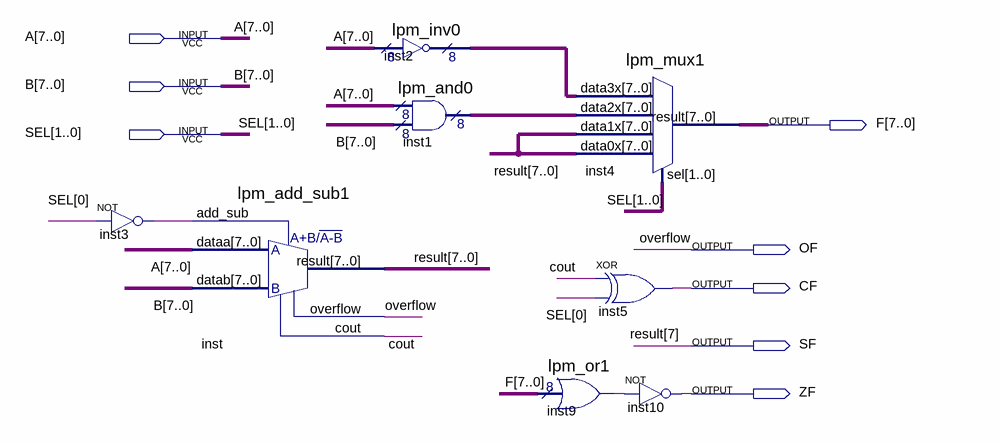
[diagram p0: schematic sheet]
// Quartus schematic ALU.bdf as structural Verilog: 8 symbols, 8 pins
module ALU (
  input  [7:0] A,
  input  [7:0] B,
  input  [1:0] SEL,
  output [7:0] F,
  output OF,
  output CF,
  output SF,
  output ZF
);

  wire cout, inst3_out, inst9_result;
  wire [6:0] result;
  wire [7:0] inst1_result, inst2_result;

  not inst3 (inst3_out, SEL[0]);
  lpm_add_sub1 inst (.dataa(A), .datab(B), .add_sub(inst3_out), .result({SF, result}), .overflow(OF), .cout(cout));
  lpm_inv0 inst2 (.data(A), .result(inst2_result));
  lpm_and0 inst1 (.data0x(A), .data1x(B), .result(inst1_result));
  lpm_or1 inst9 (.data(F), .result(inst9_result));
  lpm_mux1 inst4 (
    .data3x(inst2_result), .data2x(inst1_result), .data1x({SF, result}), .data0x({SF, result}), .sel(SEL),
    .result(F));
  xor inst5 (CF, cout, SEL[0]);
  not inst10 (ZF, inst9_result);

  // Other names for the same wires on the sheet: overflow = OF; result[7] = SF
endmodule
